# EAGLE schematic stm32f405rgt6 v70 (EAGLE 9.7.0)
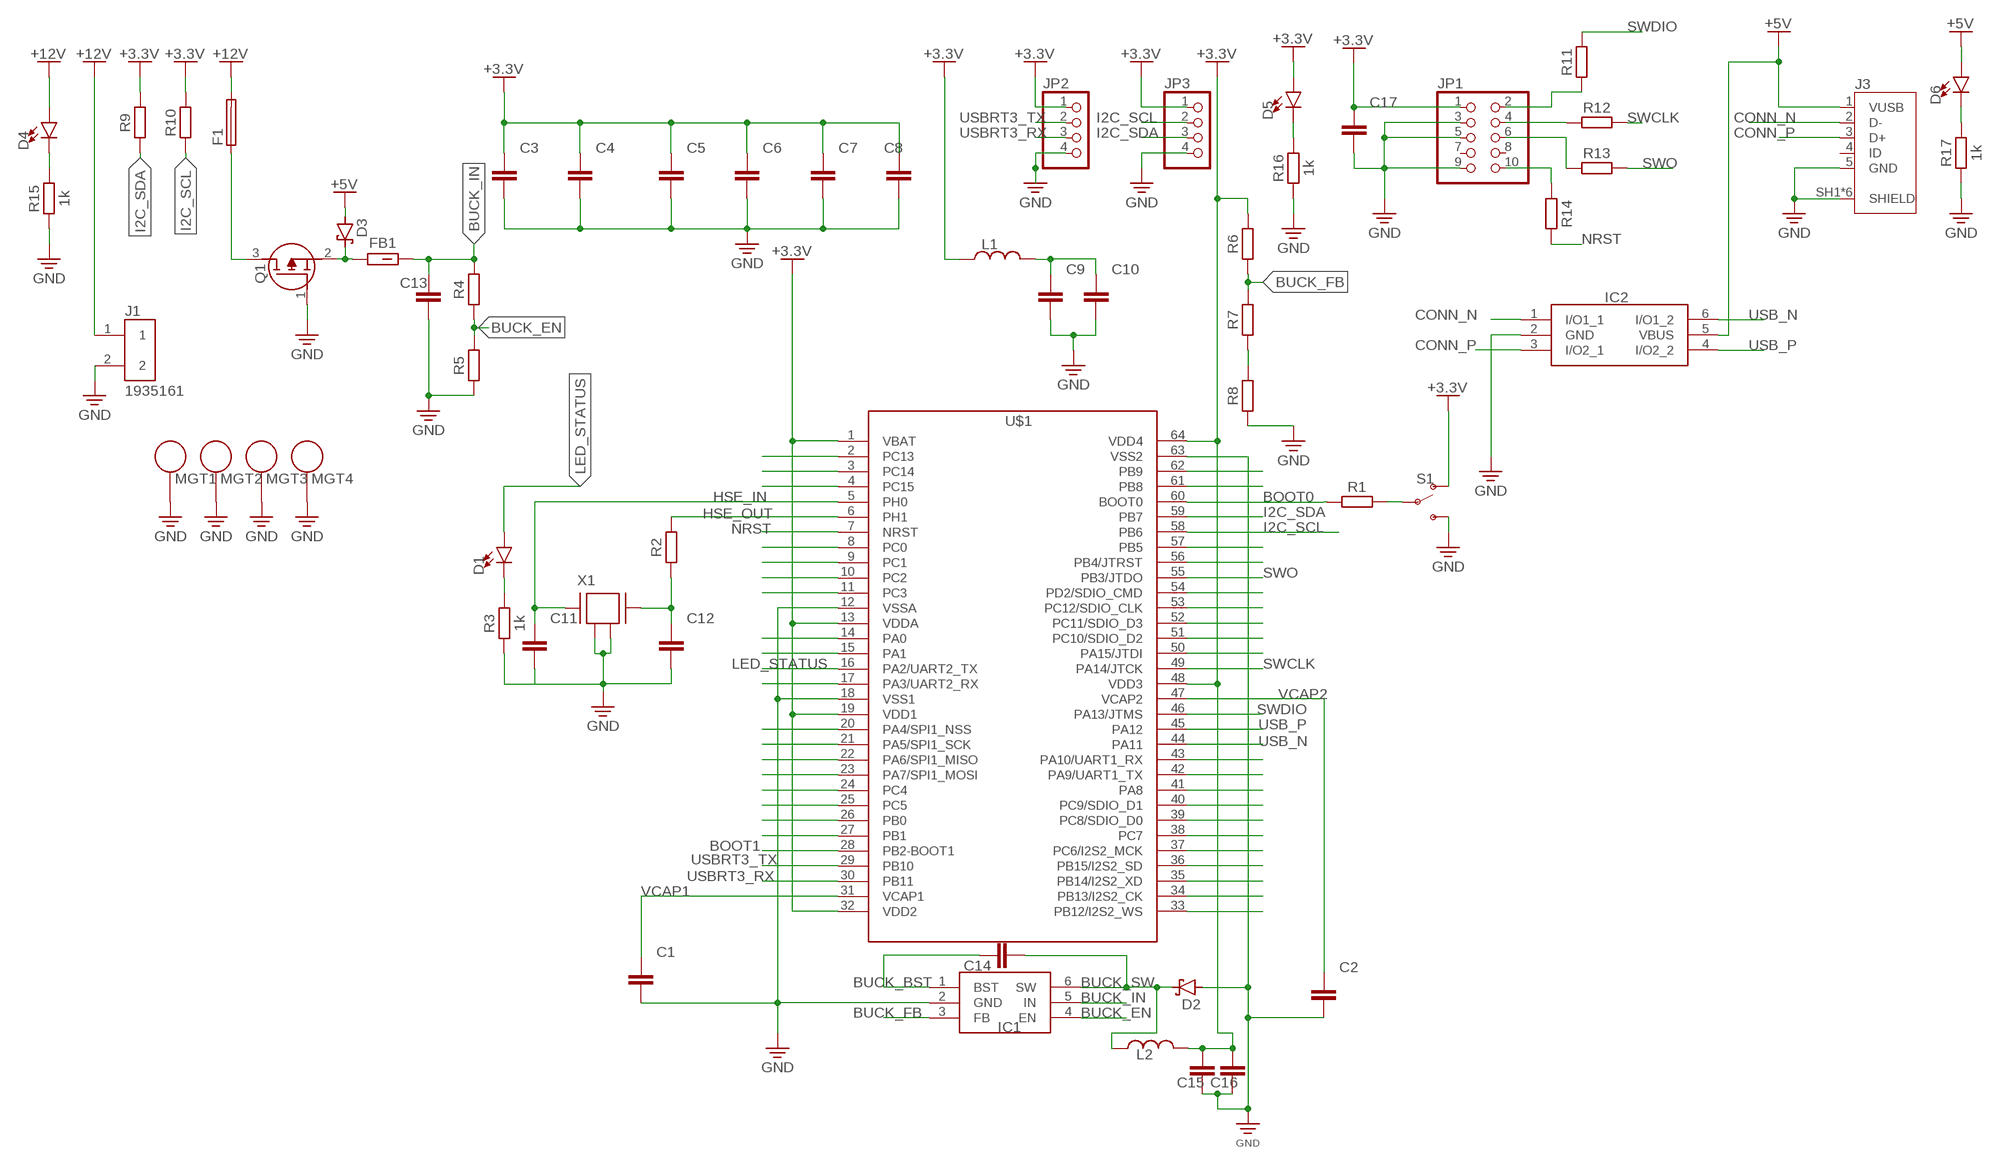
[diagram p0: schematic, sheet 1]

## Parts
C1  C_CHIP-0603(1608-METRIC)  [CAPC1608X85]
C2  C_CHIP-0603(1608-METRIC)  [CAPC1608X85]
C3  C_CHIP-0603(1608-METRIC)  [CAPC1608X85]
C4  C_CHIP-0603(1608-METRIC)  [CAPC1608X85]
C5  C_CHIP-0603(1608-METRIC)  [CAPC1608X85]
C6  C_CHIP-0603(1608-METRIC)  [CAPC1608X85]
C7  C_CHIP-0603(1608-METRIC)  [CAPC1608X85]
C8  C_CHIP-0603(1608-METRIC)  [CAPC1608X85]
C9  C_CHIP-0603(1608-METRIC)  [CAPC1608X85]
C10  C_CHIP-0603(1608-METRIC)  [CAPC1608X85]
C11  C_CHIP-0603(1608-METRIC)  [CAPC1608X85]
C12  C_CHIP-0603(1608-METRIC)  [CAPC1608X85]
C13  C_CHIP-0603(1608-METRIC)  [CAPC1608X85]
C14  C_CHIP-0603(1608-METRIC)  [CAPC1608X85]
C15  C_CHIP-0603(1608-METRIC)  [CAPC1608X85]
C16  C_CHIP-0603(1608-METRIC)  [CAPC1608X85]
C17  C_CHIP-0603(1608-METRIC)  [CAPC1608X85]
D1  LED0603  [LED-0603]
D2  MBR0520LT1G  [SOD-123]
D3  MBR0520LT1G  [SOD-123]
D4  LED0603  [LED-0603]
D5  LED0603  [LED-0603]
D6  LED0603  [LED-0603]
F1  FUSE_CHIP-0603(1608-METRIC)  [FUSC1608X60N]
FB1  FBCHIP-0603(1608-METRIC)  [BEADC1608X95N]
IC1  MP2359DJ-LF-Z  [SOT95P280X100-6N]
IC2  USBLC6-2SC6  [SOT95P280X145-6N]
J1  1935161  [PHOENIX_1935161]
J3  10118192-0001LF  [AMPHENOL_10118192-0001LF]
JP1  PINHD-2X5  [2X05]
JP2  PINHD-1X4  [1X04]
JP3  PINHD-1X4  [1X04]
L1  L_CHIP-0603(1608-METRIC)  [INDC1608X95N]
L2  L_CHIP-0603(1608-METRIC)  [INDC1608X95N]
MGT1  BEAGLEBONEBLACK_MOUNTING_HOLE  [BEAGLEBONEBLACK_MOUNTING_HOLE]
MGT2  BEAGLEBONEBLACK_MOUNTING_HOLE  [BEAGLEBONEBLACK_MOUNTING_HOLE]
MGT3  BEAGLEBONEBLACK_MOUNTING_HOLE  [BEAGLEBONEBLACK_MOUNTING_HOLE]
MGT4  BEAGLEBONEBLACK_MOUNTING_HOLE  [BEAGLEBONEBLACK_MOUNTING_HOLE]
Q1  AO3401A  [SOT95P280X125-3N]
R1  R_CHIP-0603(1608-METRIC)  [RESC1608X60]
R2  R_CHIP-0603(1608-METRIC)  [RESC1608X60]
R3  1k  R_CHIP-0603(1608-METRIC)  [RESC1608X60]
R4  R_CHIP-0603(1608-METRIC)  [RESC1608X60]
R5  R_CHIP-0603(1608-METRIC)  [RESC1608X60]
R6  R_CHIP-0603(1608-METRIC)  [RESC1608X60]
R7  R_CHIP-0603(1608-METRIC)  [RESC1608X60]
R8  R_CHIP-0603(1608-METRIC)  [RESC1608X60]
R9  R_CHIP-0603(1608-METRIC)  [RESC1608X60]
R10  R_CHIP-0603(1608-METRIC)  [RESC1608X60]
R11  R_CHIP-0603(1608-METRIC)  [RESC1608X60]
R12  R_CHIP-0603(1608-METRIC)  [RESC1608X60]
R13  R_CHIP-0603(1608-METRIC)  [RESC1608X60]
R14  R_CHIP-0603(1608-METRIC)  [RESC1608X60]
R15  1k  R_CHIP-0603(1608-METRIC)  [RESC1608X60]
R16  1k  R_CHIP-0603(1608-METRIC)  [RESC1608X60]
R17  1k  R_CHIP-0603(1608-METRIC)  [RESC1608X60]
S1  SWITCH-SPDT-SMD-RIGHT-ANGLE  [SWITCH_SPST_SMD_A]
U$1  STM32F405RG  [TQFP64]
X1  ABM3B-16.000MHZ-B2-T  [ABM3B-16.000MHZ-B2-T]

## Nets
+3.3V: C3.1 C4.1 C5.1 C6.1 C7.1 C8.1 C15.1 C16.1 C17.1 D5.A JP1.1 JP2.1 JP3.1 L1.1 L2.2 R6.2 R9.2 R10.2 S1.1(O) U$1.1(VBAT) U$1.13(VDDA) U$1.19(VDD1) U$1.32(VDD2) U$1.48(VDD3) U$1.64(VDD4)
+5V: D3.A D6.A IC2.5(VBUS) J3.1(VUSB)
+12V: D4.A F1.2 J1.1
BOOT0: R1.1 U$1.60(BOOT0)
BOOT1: U$1.28(PB2-BOOT1)
BUCK_BST: C14.1 IC1.1(BST)
BUCK_EN: IC1.4(EN) R4.1 R5.2
BUCK_FB: IC1.3(FB) R6.1 R7.2
BUCK_IN: C13.1 FB1.2 IC1.5(IN) R4.2
BUCK_SW: C14.2 D2.C IC1.6(SW) L2.1
CONN_N: IC2.1(I/O1_1) J3.2(D-)
CONN_P: IC2.3(I/O2_1) J3.3(D+)
GND: C1.2 C2.2 C3.2 C4.2 C5.2 C6.2 C7.2 C8.2 C9.2 C10.2 C11.2 C12.2 C13.2 C15.2 C16.2 C17.2 D2.A IC1.2(GND) IC2.2(GND) J1.2 J3.5(GND) J3.SH1(SHIELD) J3.SH2(SHIELD) J3.SH3(SHIELD) J3.SH4(SHIELD) J3.SH5(SHIELD) J3.SH6(SHIELD) JP1.3 JP1.5 JP1.9 JP2.4 JP3.4 MGT1.P$1 MGT2.P$1 MGT3.P$1 MGT4.P$1 Q1.1(G) R3.1 R5.1 R8.1 R15.1 R16.1 R17.1 S1.3(S) U$1.12(VSSA) U$1.18(VSS1) U$1.63(VSS2) X1.2 X1.4
HSE_IN: C11.1 U$1.5(PH0) X1.1
HSE_OUT: R2.2 U$1.6(PH1)
I2C_SCL: JP3.2 R10.1 U$1.58(PB6)
I2C_SDA: JP3.3 R9.1 U$1.59(PB7)
LED_STATUS: D1.A U$1.16(PA2/UART2_TX)
N$1: R1.2 S1.2(P)
N$2: U$1.3(PC14)
N$3: U$1.4(PC15)
N$4: C12.1 R2.1 X1.3
N$5: D1.C R3.2
N$6: U$1.43(PA10/UART1_RX)
N$7: C9.1 C10.1 L1.2
N$8: D3.C FB1.1 Q1.2(S)
N$9: F1.1 Q1.3(D)
N$10: JP1.2 R11.1
N$11: U$1.38(PC7)
N$12: U$1.42(PA9/UART1_TX)
N$13: U$1.41(PA8)
N$14: U$1.40(PC9/SDIO_D1)
N$15: U$1.39(PC8/SDIO_D0)
N$16: U$1.34(PB13/I2S2_CK)
N$18: U$1.37(PC6/I2S2_MCK)
N$19: U$1.36(PB15/I2S2_SD)
N$20: U$1.35(PB14/I2S2_XD)
N$21: U$1.33(PB12/I2S2_WS)
N$22: R7.1 R8.2
N$23: U$1.62(PB9)
N$24: U$1.61(PB8)
N$25: JP1.4 R12.1
N$26: JP1.6 R13.1
N$27: U$1.53(PC12/SDIO_CLK)
N$28: U$1.57(PB5)
N$29: U$1.56(PB4/JTRST)
N$30: JP1.10 R14.1
N$31: U$1.54(PD2/SDIO_CMD)
N$32: D4.C R15.2
N$34: U$1.52(PC11/SDIO_D3)
N$35: U$1.51(PC10/SDIO_D2)
N$36: U$1.50(PA15/JTDI)
N$37: U$1.2(PC13)
N$38: U$1.10(PC2)
N$39: U$1.8(PC0)
N$40: U$1.9(PC1)
N$41: U$1.11(PC3)
N$42: D5.C R16.2
N$43: D6.C R17.2
N$46: U$1.26(PB0)
N$47: U$1.27(PB1)
N$48: U$1.25(PC5)
N$49: U$1.23(PA7/SPI1_MOSI)
N$50: U$1.24(PC4)
N$51: U$1.22(PA6/SPI1_MISO)
N$52: U$1.20(PA4/SPI1_NSS)
N$53: U$1.21(PA5/SPI1_SCK)
N$54: U$1.17(PA3/UART2_RX)
N$55: U$1.15(PA1)
N$57: U$1.14(PA0)
NRST: R14.2 U$1.7(NRST)
SWCLK: R12.2 U$1.49(PA14/JTCK)
SWDIO: R11.2 U$1.46(PA13/JTMS)
SWO: R13.2 U$1.55(PB3/JTDO)
USB_N: IC2.6(I/O1_2) U$1.44(PA11)
USB_P: IC2.4(I/O2_2) U$1.45(PA12)
USBRT3_RX: JP2.3 U$1.30(PB11)
USBRT3_TX: JP2.2 U$1.29(PB10)
VCAP1: C1.1 U$1.31(VCAP1)
VCAP2: C2.1 U$1.47(VCAP2)
Unconnected: J3.4(ID) JP1.7 JP1.8

## Library data of the parts
C1-C17 = Capacitor:C: Capacitor - Generic; CATEGORY: Capacitor
D1 D4-D6 = SparkFun-LED:LED: LED (Generic) Standard schematic elements and footprints for 5mm, 3mm, 1206, and 0603 sized LEDs. Generic LEDs with no color specified.
D2 D3 = Diodes:MBR0520LT1G: DIODE SCHOTTKY 20V 500MA SOD123 Manufacturer's datasheet <https://www.onsemi.com/pub/Collateral/MBR0520LT1-D.PDF>; CREATED_BY: PCBLayout.com; DIGIKEY_PART_NUMBER: MBR0520LT1GOSTR-ND; MANUFACTURER: ON Semiconductor; MPN: MBR0520LT1G; PACKAGE: SOD-123
F1 = Circuit-Protection:FUSE: Fuse - Generic; CATEGORY: Circuit-Protection; SUB-CATEGORY: Fuse; VALUE: FUSE
FB1 = Filter:FB: Ferrite Bead - Generic; CATEGORY: Filter; SUB-CATEGORY: Ferrite bead; VALUE: FERRITE_BEAD
IC1 = MP2359DJ-LF-Z:MP2359DJ-LF-Z: Voltage Regulators - Switching Regulators 1A 24V 1.4MHz Non-sync Buck Source: Datasheet <http://www.mouser.com/ds/2/277/MP2359_r1.21-477634.pdf>; DESCRIPTION: Voltage Regulators - Switching Regulators 1A 24V 1.4MHz Non-sync Buck; HEIGHT: 1mm; MANUFACTURER_NAME: Monolithic Power Systems (MPS); MANUFACTURER_PART_NUMBER: MP2359DJ-LF-Z; MOUSER_PART_NUMBER: 946-MP2359DJLFZ; MOUSER_PRICE-STOCK: https://www.mouser.co.uk/ProductDetail/Monolithic-Power-Systems-MPS/MP2359DJ-LF-Z?qs=rC7bBWoQAAkgAaURxgQSyA%3D%3D
IC2 = USBLC6-2SC6:USBLC6-2SC6: TVS Diode Array Uni-Directional USBLC6-2SC6 17V, SOT-23 6-Pin Source: Datasheet <http://www.st.com/st-web-ui/static/active/en/resource/technical/document/datasheet/CD00050750.pdf>; ARROW_PART_NUMBER: USBLC6-2SC6; ARROW_PRICE-STOCK: https://www.arrow.com/en/products/usblc6-2sc6/stmicroelectronics; DESCRIPTION: TVS Diode Array Uni-Directional USBLC6-2SC6 17V, SOT-23 6-Pin; HEIGHT: 1.45mm; MANUFACTURER_NAME: STMicroelectronics; MANUFACTURER_PART_NUMBER: USBLC6-2SC6; MOUSER_PART_NUMBER: 511-USBLC6-2SC6; MOUSER_PRICE-STOCK: https://www.mouser.co.uk/ProductDetail/STMicroelectronics/USBLC6-2SC6?qs=po45yt2pPpu%2FhNIlwQdTlg%3D%3D
J1 = phoenix:1935161: Conn Terminal Blocks 2 POS 5mm Solder ST Thru-Hole 16A; MANUFACTURER: Phoenix Contact
J3 = USB-micro:10118192-0001LF: Single Port 5 Contact Horizontal Right Angle Shielded Micro B USB 2.0 Connector; MANUFACTURER: Amphenol; PARTREV: B; STANDARD: Manufacturer Recommendation
JP1 = Connector:PINHD-2X5: PIN HEADER; CATEGORY: CONNECTOR; SUB-CATEGORY: PIN-HEADER
JP2 JP3 = Connector:PINHD-1X4: PIN HEADER; CATEGORY: CONNECTOR; SUB-CATEGORY: PIN-HEADER
L1 L2 = Inductor:L: Inductor Fixed - Generic; CATEGORY: Inductor; SUB-CATEGORY: Fixed
MGT1-MGT4 = BeagleBone_Black_Wireless:BEAGLEBONEBLACK_MOUNTING_HOLE: Chassis Mounting Hole w/GND connection ability
Q1 = AO3401A:AO3401A: 30V P-Channel MOSFET Source: Datasheet <http://www.aosmd.com/pdfs/datasheet/AO3401A.pdf>; ARROW_PART_NUMBER: AO3401A; ARROW_PRICE-STOCK: https://www.arrow.com/en/products/ao3401a/alpha-and-omega-semiconductor; DESCRIPTION: 30V P-Channel MOSFET; HEIGHT: 1.25mm; MANUFACTURER_NAME: Alpha & Omega Semiconductors; MANUFACTURER_PART_NUMBER: AO3401A
R1-R17 = Resistor:R: Resistor Fixed - Generic; CATEGORY: Resistor; SUB-CATEGORY: Fixed
S1 = One_Dimensional_Pong:SWITCH-SPDT: Single Pole, Double Throw (SPDT) Switch Single-pole, double-throw (SPDT) switch. Variant Overview SMD-AYZ0202 Surface Mount DPDT Switch <https://www.sparkfun.com/products/597> (COM-00597) Used on e.g. LilyPad Arduino USB - ATmega32U4 Board <https://www.sparkfun.com/products/12049> PTH-11.6X4.0MM SPDT Mini Power Switch <https://www.sparkfun.com/products/102> (COM-00102) Used on e.g. SparkFun Simon Says - Through-Hole Soldering Kit <https://www.sparkfun.com/products/10547> (KIT-10547) PTH-11.6X4.0MM-KIT KIT version of SPDT Mini Power Switch - Simplifies soldering by removing tStop of switch pins - only one side can be soldered. PTH-11.6X4.0MM-LOCK LOCK version of SPDT Mini Power Switch - Offset pins hold switch in place for easier soldering. SMD-RIGHT-ANGLE Surface Mount Right Angle Switch <https://www.sparkfun.com/products/10860> (COM-10860) Used on e.g. SparkFun ESP8266 Thing <https://www.sparkfun.com/products/13231>; PROD_ID: SWCH-10651; SF_ID: COM-00597; SF_SKU: COM-10860
U$1 = SparkFun-IC-Microcontroller:STM32F405RG: STM32F405RGT6 ARM DSP Chip used on the WAV Trigger board. IC MCU 32BIT 1MB FLASH 64LQFP Datasheet <https://cdn.sparkfun.com/datasheets/Widgets/STM32F405RGT6.pdf> SparkFun Products WAV Trigger <https://www.sparkfun.com/products/13660> (WIG-13660); PROD_ID: IC-11709; SPICEPREFIX: X; VALUE: STM32F405RGT6
X1 = Crystals_Oscillators:ABM3B-16.000MHZ-B2-T: CRYSTAL 16.0000MHZ 18PF SMD Manufacturer's datasheet <https://abracon.com/Resonators/abm3b.pdf>; CREATED_BY: PCBLayout.com; DIGIKEY_PART_NUMBER: 535-9122-2-ND; MANUFACTURER: Abracon LLC; MPN: ABM3B-16.000MHZ-B2-T; PACKAGE: SMD 4

## Module X
Ports: 

### Library data of the parts